# Altium schematic sheet РЕУН.468323.001_Audio.SchDoc: =Name-1str
size 420 x 297 mm; SheetNumber: 5; Вид изделия: Документация; Раздел: Документация; Код документа: Э3; Вид документа: Схема электрическая принципиальная; Класс документа: Конструкторский документ; Создавать изделие в PLM: Yes; DocumentCode: РЕУН.468323.001 Э3 2D; DocumentView: Схема электрическая принципиальная; DocumentClass: Конструкторский документ; ProductView: Документация; Format: А3
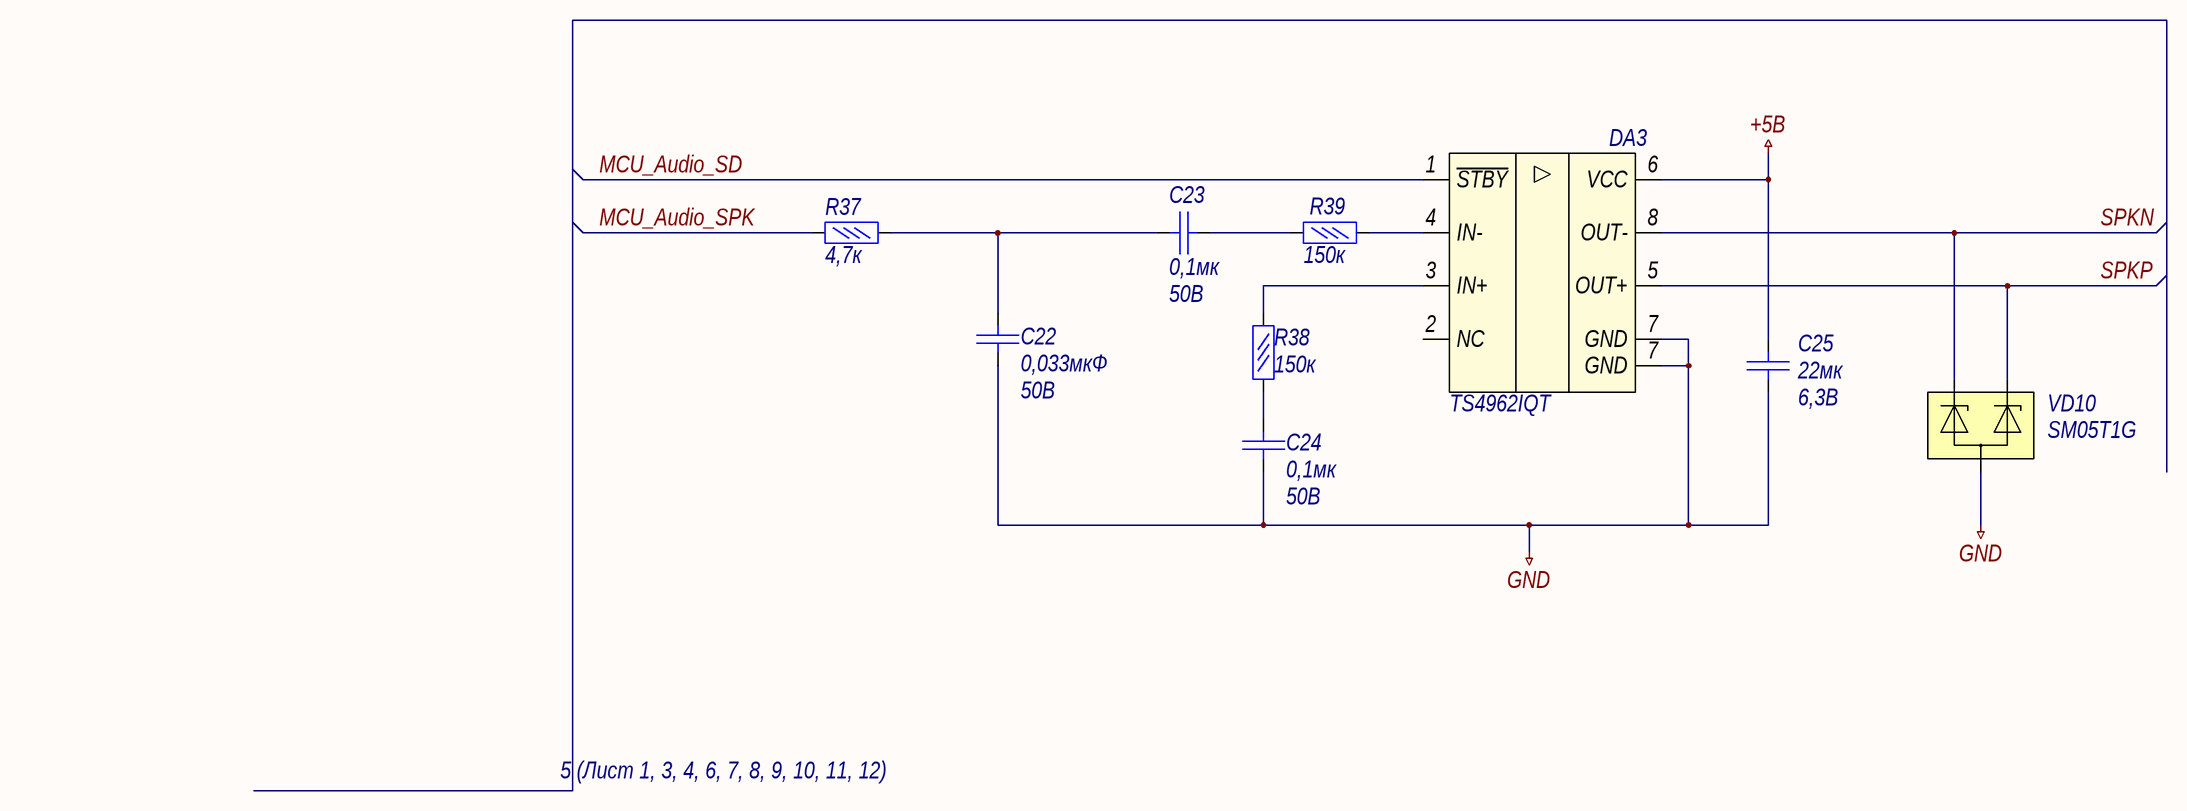
[diagram p0: РЕУН.468323.001_Audio.SchDoc]

## Parts
C22  Voltage: 50В  [C0805_AA]  (hidden comment: 0,033мкФ)
C23  Voltage: 50В  [C0805_AA]  (hidden comment: 0,1мк)
C24  Voltage: 50В  [C0805_AA]  (hidden comment: 0,1мк)
C25  Voltage: 6,3В  [C0805_AA]  (hidden comment: 22мк)
DA3  TS4962IQT
R37  4,7к  [R1206]
R38  150к  [R1206]
R39  150к  [R1206]
VD10  SM05T1G

## Nets
+5В: C25.2 DA3.6(VCC)
GND: C22.1 C24.1 C25.1 DA3.7(GND) VD10.3
MCU_Audio_SD: DA3.1(~{STBY})
MCU_Audio_SPK: R37.2
SPKN: DA3.8(OUT-) VD10.1
SPKP: DA3.5(OUT+) VD10.2
NetC22_2: C22.2 C23.2 R37.1
NetC23_1: C23.1 R39.2
NetC24_2: C24.2 R38.1
NetDA3_3: DA3.3(IN+) R38.2
NetDA3_4: DA3.4(IN-) R39.1

Not connected (* = marked no-connect by the designer): DA3 2(NC)

## Notes on the sheet
- 5 (Лист 1, 3, 4, 6, 7, 8, 9, 10, 11, 12)
- Подп. и дата
- Инв. № дубл.
- Взам. инв. №
- Инв. № подл.
- Лист
- Изм.
- № докум.
- Подп.
- Дата
- Копировал
- Формат

## Library data of the parts
C22-C25 = Конденсатор кер.
  C22: Value: 0,033мкФ
  C23 C24: Value: 0,1мк
  C25: Value: 22мк
DA3 = TS4962: Audio Power Amplifier
R37-R39 = Резистор  0,05Вт: Резистор 0,05Вт; Power rating: 0,05Вт
  R37: Value: 4,7к
  R38 R39: Value: 150к
VD10 = ZenerArray2: Сборка TVS-диодов; Parameter 1: *